# EAGLE design MCB-iMX7-WARP-v1.0.0 (EAGLE 7.7.0)

## Sheet 1 of 2
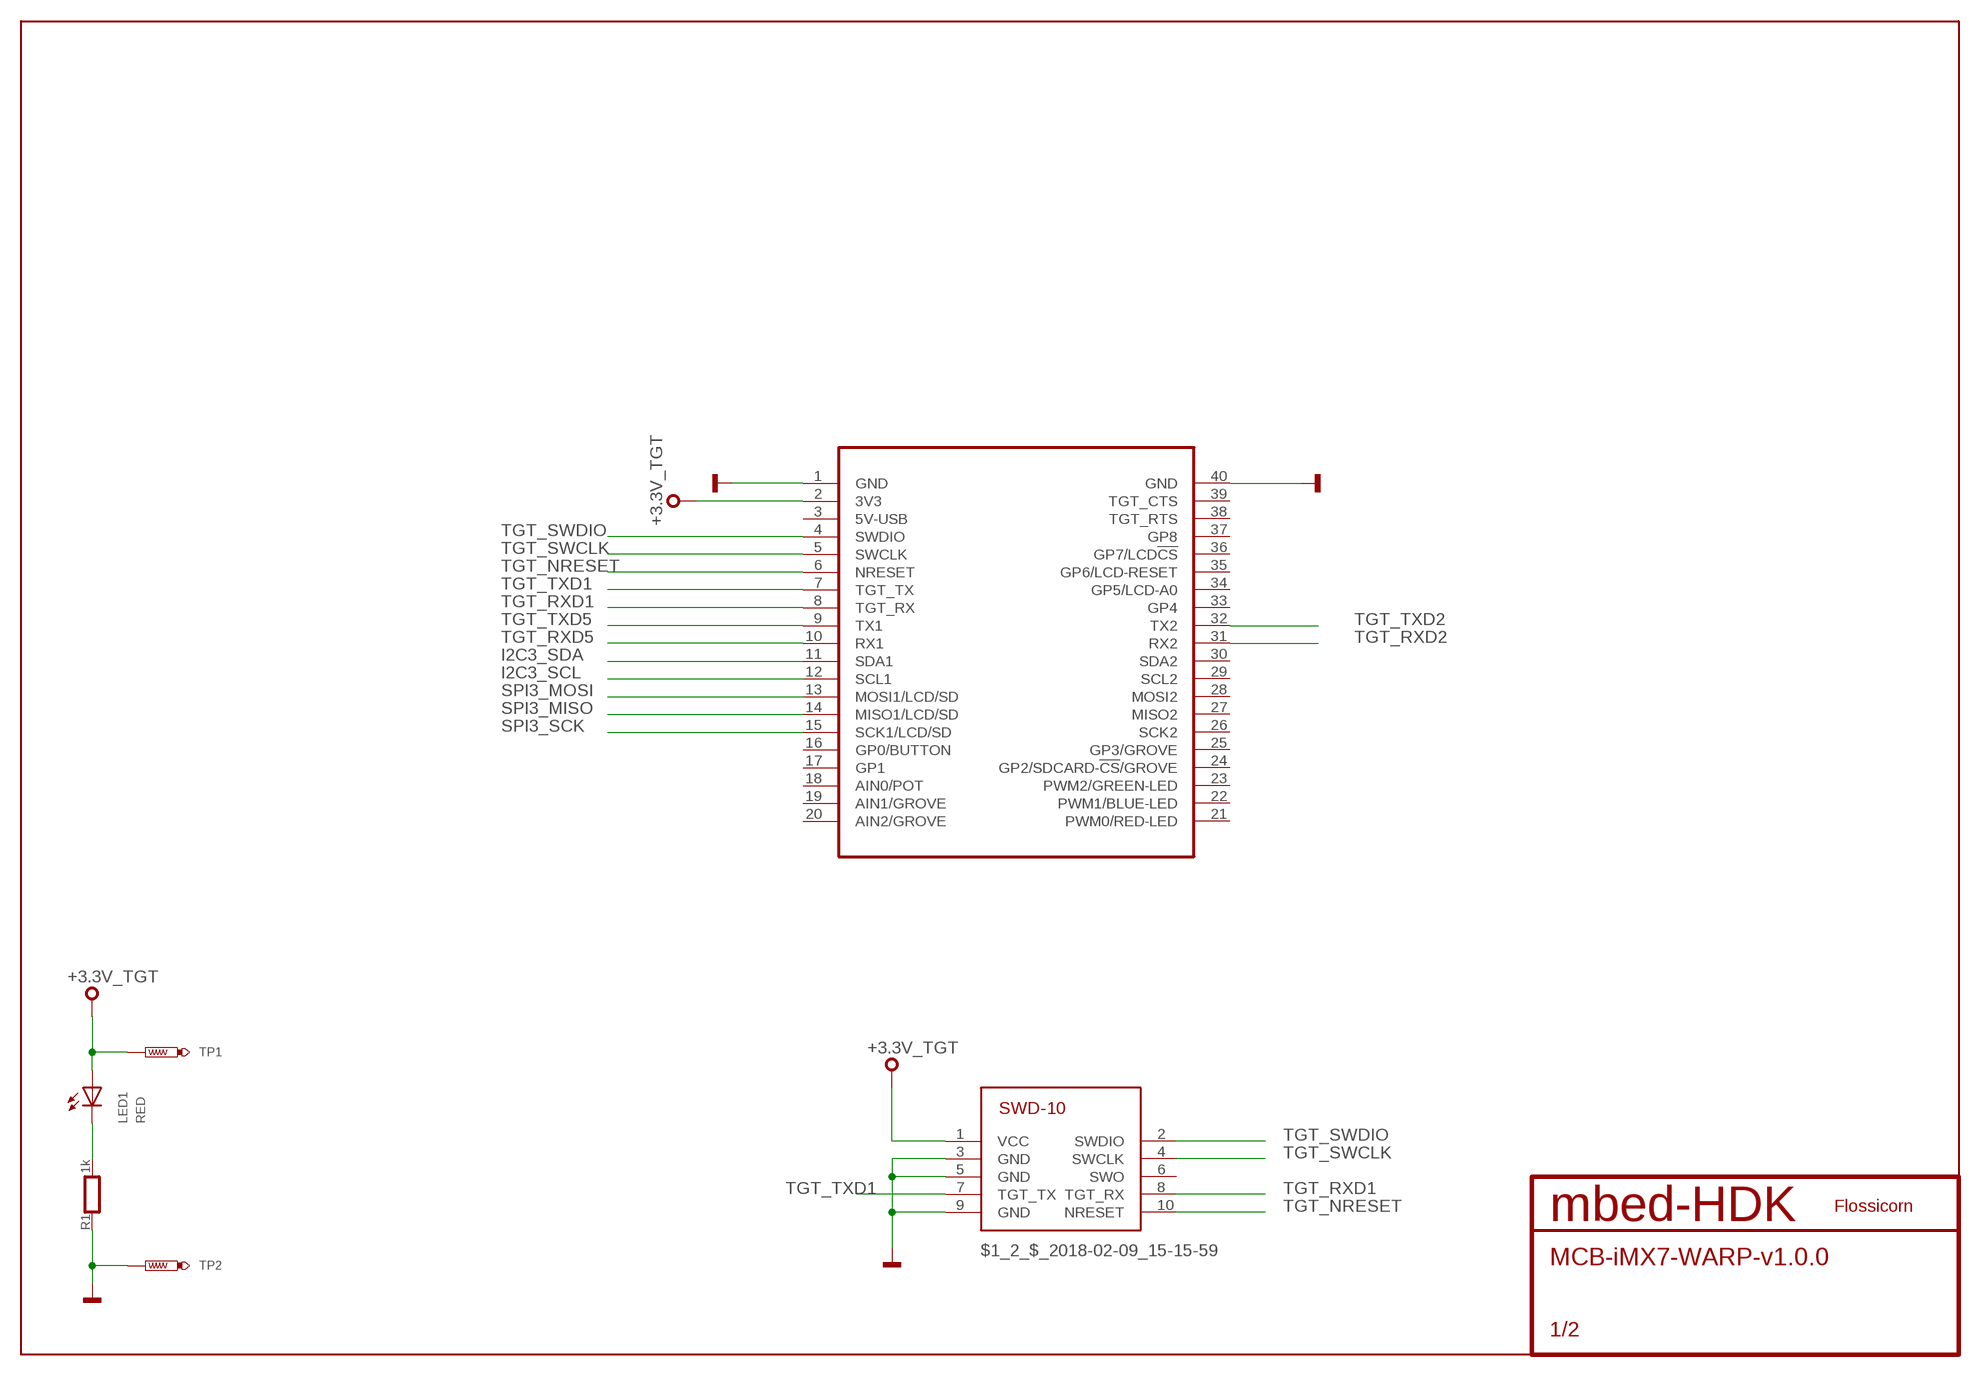
[diagram p0: schematic, sheet 1]

### Parts
$1_2_$_2018-02-09_15-15-59  SWD-10/TC2050_SMD  [FTSH-105-02]
LED1  RED  SMD_LED0603  [CHIPLED_0603]
MOD1  MODULE_DAUGHTER  [MODULE_DAUGHTER]
R1  1k  RESISTOR0603  [0603]
SS1  FLOSSICORN0.5  [FLOSSICORN-0.5]
TP1  TEST-POINT-50R-PTH  [TP50-PTH]
TP2  TEST-POINT-50R-PTH  [TP50-PTH]

### Nets
+3.3V_TGT: $1_2_$_2018-02-09_15-15-59.1(VCC) LED1.A MOD1.2(3V3) TP1.TP ; also sheet 2
GND: $1_2_$_2018-02-09_15-15-59.3(GND) $1_2_$_2018-02-09_15-15-59.5(GND) $1_2_$_2018-02-09_15-15-59.9(GND) MOD1.1(GND) MOD1.40(GND) R1.1 TP2.TP ; also sheet 2
I2C3_SCL: MOD1.12(SCL1) ; also sheet 2
I2C3_SDA: MOD1.11(SDA1) ; also sheet 2
PA_1: LED1.C R1.2
SPI3_MISO: MOD1.14(MISO1/LCD/SD) ; also sheet 2
SPI3_MOSI: MOD1.13(MOSI1/LCD/SD) ; also sheet 2
SPI3_SCK: MOD1.15(SCK1/LCD/SD) ; also sheet 2
TGT_NRESET: $1_2_$_2018-02-09_15-15-59.10(NRESET) MOD1.6(NRESET)
TGT_RXD1: $1_2_$_2018-02-09_15-15-59.8(TGT_RX) MOD1.8(TGT_RX) ; also sheet 2
TGT_RXD2: MOD1.31(RX2) ; also sheet 2
TGT_RXD5: MOD1.10(RX1) ; also sheet 2
TGT_SWCLK: $1_2_$_2018-02-09_15-15-59.4(SWCLK) MOD1.5(SWCLK) ; also sheet 2
TGT_SWDIO: $1_2_$_2018-02-09_15-15-59.2(SWDIO) MOD1.4(SWDIO) ; also sheet 2
TGT_TXD1: $1_2_$_2018-02-09_15-15-59.7(TGT_TX) MOD1.7(TGT_TX) ; also sheet 2
TGT_TXD2: MOD1.32(TX2) ; also sheet 2
TGT_TXD5: MOD1.9(TX1) ; also sheet 2
Unconnected: $1_2_$_2018-02-09_15-15-59.6(SWO) MOD1.3(5V-USB) MOD1.16(GP0/BUTTON) MOD1.17(GP1) MOD1.18(AIN0/POT) MOD1.19(AIN1/GROVE) MOD1.20(AIN2/GROVE) MOD1.21(PWM0/RED-LED) MOD1.22(PWM1/BLUE-LED) MOD1.23(PWM2/GREEN-LED) MOD1.24(GP2/SDCARD-!CS!/GROVE) MOD1.25(GP3/GROVE) MOD1.26(SCK2) MOD1.27(MISO2) MOD1.28(MOSI2) MOD1.29(SCL2) MOD1.30(SDA2) MOD1.33(GP4) MOD1.34(GP5/LCD-A0) MOD1.35(GP6/LCD-RESET) MOD1.36(GP7/LCD!CS) MOD1.37(GP8) MOD1.38(TGT_RTS) MOD1.39(TGT_CTS)

## Sheet 2 of 2
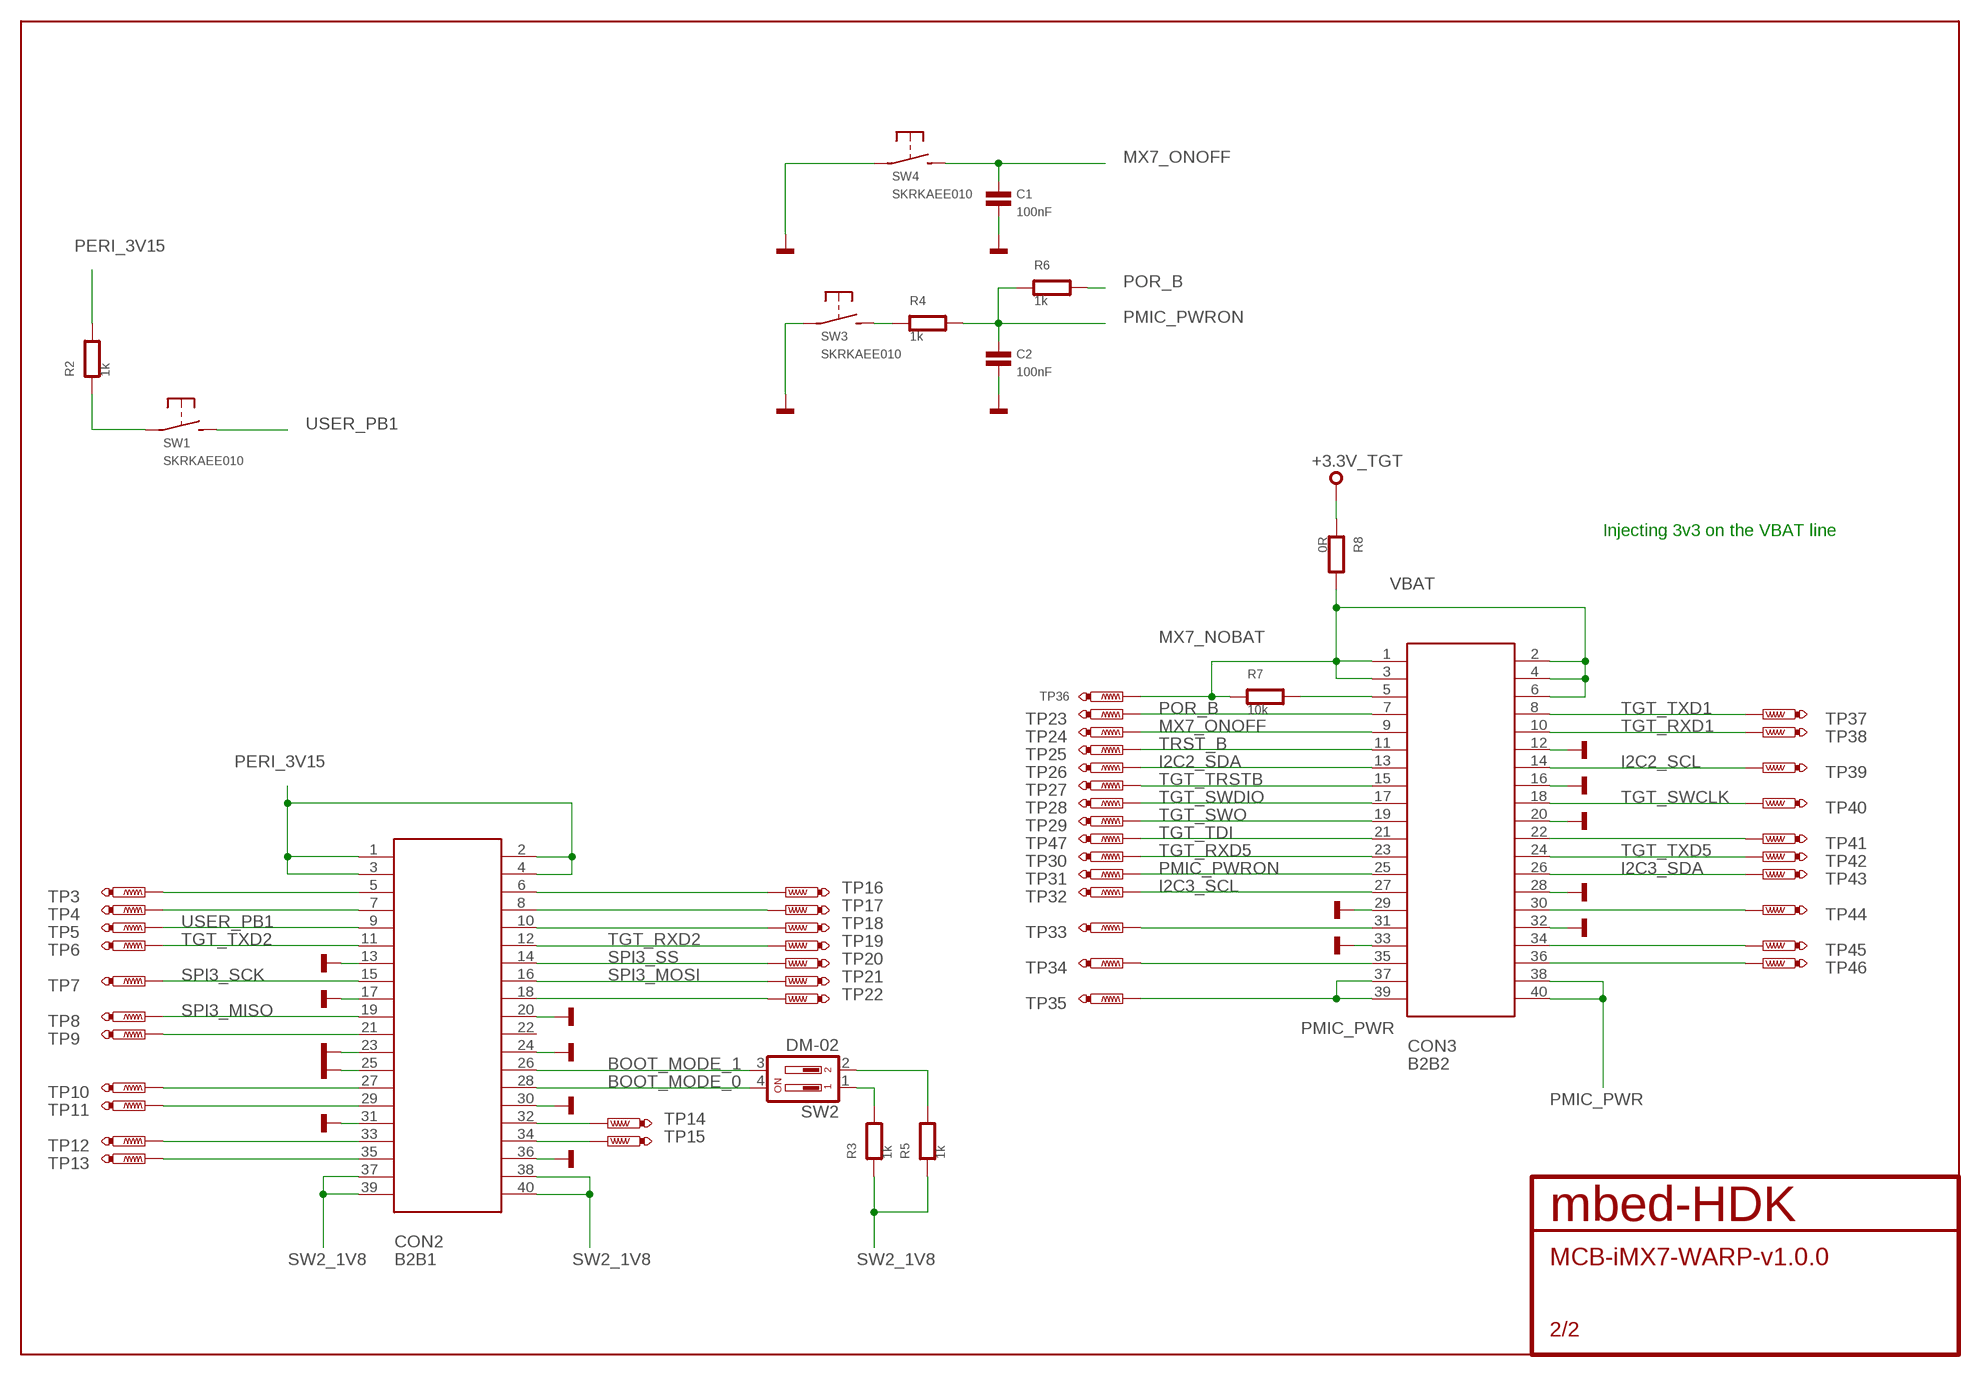
[diagram p1: schematic, sheet 2]

### Parts
C1  100nF  CAPACITOR0603  [0603]
C2  100nF  CAPACITOR0603  [0603]
CON2  B2B1  DF40HC-XX-40DS-XX-V  [DF40HC-XX-40DS-XX-V]
CON3  B2B2  DF40HC-XX-40DS-XX-V  [DF40HC-XX-40DS-XX-V]
R2  1k  RESISTOR0603  [0603]
R3  1k  RESISTOR0603  [0603]
R4  1k  RESISTOR0603  [0603]
R5  1k  RESISTOR0603  [0603]
R6  1k  RESISTOR0603  [0603]
R7  10k  RESISTOR0603  [0603]
R8  0R  RESISTOR0603  [0603]
SW1  SKRKAEE010  [SKRKAEE010]
SW2  DM-02  [DM-02]
SW3  SKRKAEE010  [SKRKAEE010]
SW4  SKRKAEE010  [SKRKAEE010]
TP3  PTR1TP06R  [TP06R]
TP4  PTR1TP06R  [TP06R]
TP5  PTR1TP06R  [TP06R]
TP6  PTR1TP06R  [TP06R]
TP7  PTR1TP06R  [TP06R]
TP8  PTR1TP06R  [TP06R]
TP9  PTR1TP06R  [TP06R]
TP10  PTR1TP06R  [TP06R]
TP11  PTR1TP06R  [TP06R]
TP12  PTR1TP06R  [TP06R]
TP13  PTR1TP06R  [TP06R]
TP14  PTR1TP06R  [TP06R]
TP15  PTR1TP06R  [TP06R]
TP16  PTR1TP06R  [TP06R]
TP17  PTR1TP06R  [TP06R]
TP18  PTR1TP06R  [TP06R]
TP19  PTR1TP06R  [TP06R]
TP20  PTR1TP06R  [TP06R]
TP21  PTR1TP06R  [TP06R]
TP22  PTR1TP06R  [TP06R]
TP23  PTR1TP06R  [TP06R]
TP24  PTR1TP06R  [TP06R]
TP25  PTR1TP06R  [TP06R]
TP26  PTR1TP06R  [TP06R]
TP27  PTR1TP06R  [TP06R]
TP28  PTR1TP06R  [TP06R]
TP29  PTR1TP06R  [TP06R]
TP30  PTR1TP06R  [TP06R]
TP31  PTR1TP06R  [TP06R]
TP32  PTR1TP06R  [TP06R]
TP33  PTR1TP06R  [TP06R]
TP34  PTR1TP06R  [TP06R]
TP35  PTR1TP10R  [TP10R]
TP36  TEST-POINT-50R-SMD  [TP50-SMD]
TP37  PTR1TP06R  [TP06R]
TP38  PTR1TP06R  [TP06R]
TP39  PTR1TP06R  [TP06R]
TP40  PTR1TP06R  [TP06R]
TP41  PTR1TP06R  [TP06R]
TP42  PTR1TP06R  [TP06R]
TP43  PTR1TP06R  [TP06R]
TP44  PTR1TP06R  [TP06R]
TP45  PTR1TP06R  [TP06R]
TP46  PTR1TP06R  [TP06R]
TP47  PTR1TP06R  [TP06R]

### Nets
+3.3V_TGT: R8.1 ; also sheet 1
BOOT_MODE_0: CON2.28 SW2.4
BOOT_MODE_1: CON2.26 SW2.3
GND: C1.2 C2.2 CON2.13 CON2.17 CON2.20 CON2.23 CON2.24 CON2.25 CON2.30 CON2.31 CON2.36 CON3.12 CON3.16 CON3.20 CON3.28 CON3.29 CON3.32 CON3.33 SW3.P$1(P) SW4.P$1(P) ; also sheet 1
I2C2_SCL: CON3.14 TP39.TP
I2C2_SDA: CON3.13 TP26.TP
I2C3_SCL: CON3.27 TP32.TP ; also sheet 1
I2C3_SDA: CON3.26 TP43.TP ; also sheet 1
MX7_NOBAT: CON3.5 R7.2
MX7_ONOFF: C1.1 CON3.9 SW4.P$2(S) TP24.TP
N$1: R4.1 SW3.P$2(S)
N$10: R2.1 SW1.P$1(P)
N$15: CON3.36 TP46.TP
N$16: CON3.22 TP41.TP
N$17: CON3.30 TP44.TP
N$18: CON3.34 TP45.TP
N$20: R3.2 SW2.1
N$21: R5.2 SW2.2
N$23: CON3.31 TP33.TP
N$24: CON3.35 TP34.TP
N$25: CON2.5 TP3.TP
N$26: CON2.7 TP4.TP
N$27: CON2.21 TP9.TP
N$28: CON2.27 TP10.TP
N$29: CON2.29 TP11.TP
N$30: CON2.33 TP12.TP
N$31: CON2.35 TP13.TP
N$32: CON2.34 TP15.TP
N$33: CON2.32 TP14.TP
N$35: CON2.18 TP22.TP
N$36: CON2.10 TP18.TP
N$37: CON2.8 TP17.TP
N$38: CON2.6 TP16.TP
PERI_3V15: CON2.1 CON2.2 CON2.3 CON2.4 R2.2
PMIC_PWR: CON3.37 CON3.38 CON3.39 CON3.40 TP35.TP
PMIC_PWRON: C2.1 CON3.25 R4.2 R6.1 TP31.TP
POR_B: CON3.7 R6.2 TP23.TP
SPI3_MISO: CON2.19 TP8.TP ; also sheet 1
SPI3_MOSI: CON2.16 TP21.TP ; also sheet 1
SPI3_SCK: CON2.15 TP7.TP ; also sheet 1
SPI3_SS: CON2.14 TP20.TP
SW2_1V8: CON2.37 CON2.38 CON2.39 CON2.40 R3.1 R5.1
TGT_RXD1: CON3.10 TP38.TP ; also sheet 1
TGT_RXD2: CON2.12 TP19.TP ; also sheet 1
TGT_RXD5: CON3.23 TP30.TP ; also sheet 1
TGT_SWCLK: CON3.18 TP40.TP ; also sheet 1
TGT_SWDIO: CON3.17 TP28.TP ; also sheet 1
TGT_SWO: CON3.19 TP29.TP
TGT_TDI: CON3.21 TP47.TP
TGT_TRSTB: CON3.15 TP27.TP
TGT_TXD1: CON3.8 TP37.TP ; also sheet 1
TGT_TXD2: CON2.11 TP6.TP ; also sheet 1
TGT_TXD5: CON3.24 TP42.TP ; also sheet 1
TRST_B: CON3.11 TP25.TP
USER_PB1: CON2.9 SW1.P$2(S) TP5.TP
VBAT: CON3.1 CON3.2 CON3.3 CON3.4 CON3.6 R7.1 R8.2 TP36.TP
Unconnected: CON2.22

### Notes on the sheet
- Injecting 3v3 on the VBAT line

## Library data of the parts
$1_2_$_2018-02-09_15-15-59 = mbed-HDK-Connector:SWD-10/TC2050: 1mm pitch 10-Pin Cortex Programming Header with optional TC2050 footprint solderless interchangeable
C1 C2 = mbed-HDK-RLC:CAPACITOR: Capacitor
CON2 CON3 = Treadstone:DF40HC-XX-40DS-XX-V
LED1 = mbed-HDK-Optical:SMD_LED: LED SMD, Colour Red; MF: Wurth Electronics Inc; MFN: 150060RS75000; OC-DIGIKEY: 732-4978-1-ND; OC-MOUSER: 710-150060RS75000; OC-NEWARK: 2322071
MOD1 = blackbriar:MODULE_DAUGHTER
R1-R8 = mbed-HDK-RLC:RESISTOR: Resistor
SS1 = blackbriar:FLOSSICORN
SW1 SW3 SW4 = mbed-HDK-Switch:SKRKAEE010: MOMENTARY SWITCH PUSH VERTICAL (SPST); MF: ALPS; MFN: SKRKAEE010; OC-MOUSER: 688-SKRKAE
SW2 = LabBoard:DM-02
TP1 TP2 TP36 = mbed-HDK:TEST-POINT
TP3-TP35 TP37-TP47 = testpad:PTR1: TEST PIN

## Board
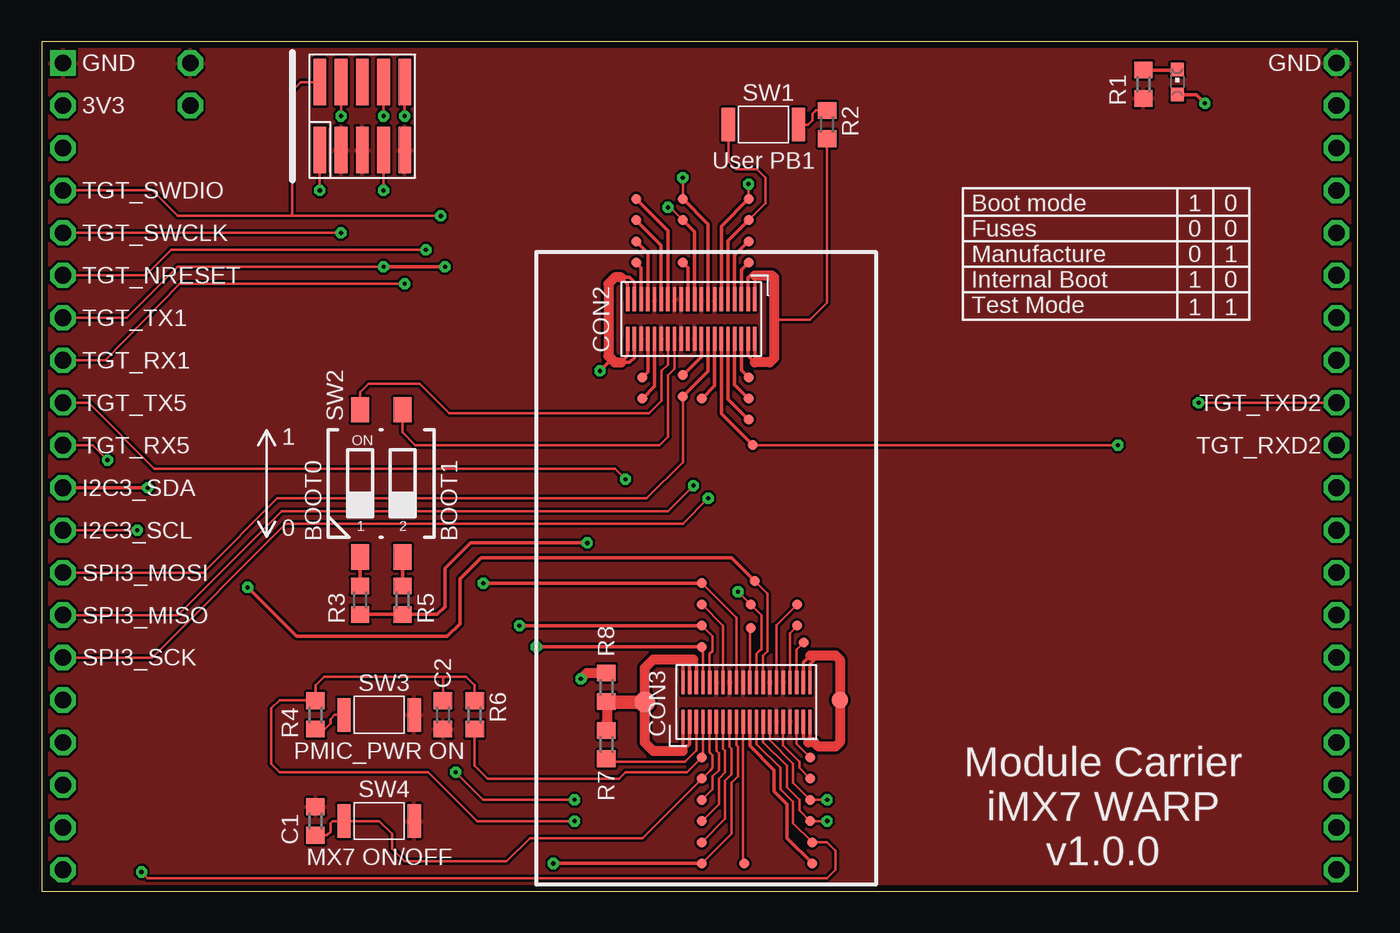
[diagram p2: board, top side]
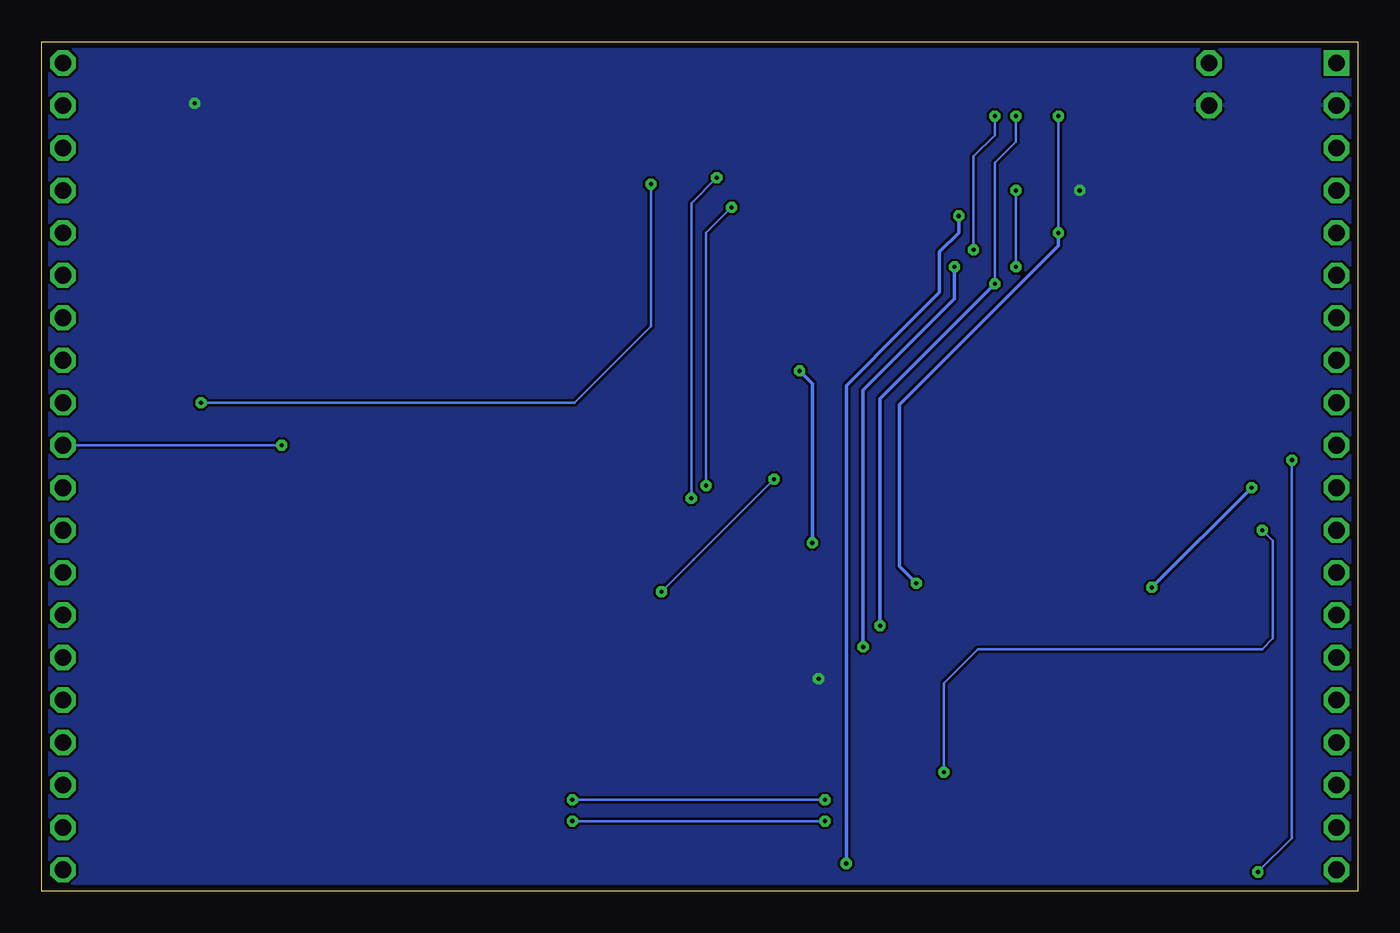
[diagram p3: board, bottom side, seen from below]

Size 78.74 x 50.8 mm. Coordinates in mm from the lower left corner, seen from the top.
Copper layers ((1*16)): Top 0.035mm / dielectric 0.8mm / Bottom 0.035mm
Design rules "mbed-HDK-6-6-2-layer": minimum track width 6mil, minimum drill 9mil, track to track 6mil, track to pad 6mil, pad to pad 6mil, via to via 6mil, smd to smd 6mil, copper to edge 15mil, drill to drill 8mil, minimum pad ring 10mil, minimum via ring 8mil, stop-mask expansion 4mil, vias tented up to drill 0mil, thermal gap 6mil

### Footprints (pad centres in the part's own frame; a part is rotated, then mirrored left to right if it is on the bottom)
FTSH-105-02 = smd 0.762 x 2.794: 1 0.381,-2.032; 2 0.381,2.032; 3 1.651,-2.032; 4 1.651,2.032; 5 2.921,-2.032; 6 2.921,2.032; 7 4.191,-2.032; 8 4.191,2.032; 9 5.461,-2.032; 10 5.461,2.032
0603 = smd 1 x 1.1: 1 -0.85,0; 2 0.85,0
DF40HC-XX-40DS-XX-V = smd 0.2 x 1.43: 1 -3.8,-1.175; 2 -3.8,1.175; 3 -3.4,-1.175; 4 -3.4,1.175; 5 -3,-1.175; 6 -3,1.175; 7 -2.6,-1.175; 8 -2.6,1.175; 9 -2.2,-1.175; 10 -2.2,1.175; 11 -1.8,-1.175; 12 -1.8,1.175; 13 -1.4,-1.175; 14 -1.4,1.175; 15 -1,-1.175; 16 -1,1.175; 17 -0.6,-1.175; 18 -0.6,1.175; 19 -0.2,-1.175; 20 -0.2,1.175; 21 0.2,-1.175; 22 0.2,1.175; 23 0.6,-1.175; 24 0.6,1.175; 25 1,-1.175; 26 1,1.175; 27 1.4,-1.175; 28 1.4,1.175; 29 1.8,-1.175; 30 1.8,1.175; 31 2.2,-1.175; 32 2.2,1.175; 33 2.6,-1.175; 34 2.6,1.175; 35 3,-1.175; 36 3,1.175; 37 3.4,-1.175; 38 3.4,1.175; 39 3.8,-1.175; 40 3.8,1.175
CHIPLED_0603 = smd 0.8 x 0.8: A 0,-0.75; C 0,0.75
MODULE_DAUGHTER = drill 1 square: 1 0,0 | drill 1 octagon: 2 0,-2.54; 3 0,-5.08; 4 0,-7.62; 5 0,-10.16; 6 0,-12.7; 7 0,-15.24; 8 0,-17.78; 9 0,-20.32; 10 0,-22.86; 11 0,-25.4; 12 0,-27.94; 13 0,-30.48; 14 0,-33.02; 15 0,-35.56; 16 0,-38.1; 17 0,-40.64; 18 0,-43.18; 19 0,-45.72; 20 0,-48.26; 21 76.2,-48.26; 22 76.2,-45.72; 23 76.2,-43.18; 24 76.2,-40.64; 25 76.2,-38.1; 26 76.2,-35.56; 27 76.2,-33.02; 28 76.2,-30.48; 29 76.2,-27.94; 30 76.2,-25.4; 31 76.2,-22.86; 32 76.2,-20.32; 33 76.2,-17.78; 34 76.2,-15.24; 35 76.2,-12.7; 36 76.2,-10.16; 37 76.2,-7.62; 38 76.2,-5.08; 39 76.2,-2.54; 40 76.2,0
SKRKAEE010 = smd 0.8 x 2: P$1 -2.1,0; P$2 2.1,0
DM-02 = smd 1.1 x 1.5: 1 -1.27,-4.4; 2 1.27,-4.4; 3 1.27,4.4; 4 -1.27,4.4
TP50-PTH = drill 1 octagon: TP 0,0
TP06R = smd 0.6 x 0.6: TP 0,0
TP10R = smd 1 x 1: TP 0,0
TP50-SMD = smd 1.27 x 1.27: TP 0,0

### Placement (x,y rotation side)
$1_2_$_2018-02-09_15-15-59  16.26,46.36 0 top
C1  16.38,4.19 90 top
C2  24,10.54 270 top
CON2  38.86,34.21 180 top
CON3  42.16,11.3 0 top
LED1  67.94,48.39 0 top
MOD1  1.27,49.53 0 top
R1  65.91,48.26 90 top
R2  46.99,45.85 270 top
R3  19.05,17.4 90 top
R4  16.38,10.54 90 top
R5  21.59,17.4 90 top
R6  25.91,10.54 270 top
R7  33.78,8.76 270 top
R8  33.78,12.19 270 top
SS1  25.65,41.27 0 top
SW1  43.18,45.85 180 top
SW2  20.32,24.38 0 top
SW3  20.19,10.54 180 top
SW4  20.19,4.19 180 top
TP1  8.89,46.99 0 top
TP2  8.89,49.53 0 top
TP3  42.29,37.59 0 top
TP4  42.29,38.86 0 top
TP5  42.29,40.13 270 top
TP6  42.29,41.4 270 top
TP7  38.35,41.4 270 top
TP8  38.35,40.13 270 top
TP9  38.35,37.59 0 top
TP10  35.56,41.4 0 top
TP11  35.56,40.13 0 top
TP12  35.56,38.86 0 top
TP13  35.56,37.59 0 top
TP14  35.94,29.46 0 top
TP15  35.94,30.73 0 top
TP16  42.29,30.73 0 top
TP17  42.29,29.46 0 top
TP18  42.29,28.19 0 top
TP19  42.55,26.67 270 top
TP20  39.5,29.46 270 top
TP21  38.35,29.59 270 top
TP22  38.35,30.86 0 top
TP23  39.5,8 90 top
TP24  39.5,6.73 90 top
TP25  39.5,5.46 90 top
TP26  39.5,4.19 90 top
TP27  39.5,2.92 90 top
TP28  39.5,1.65 90 top
TP29  42.04,1.65 90 top
TP30  46.1,2.92 90 top
TP31  45.97,4.19 90 top
TP32  45.97,5.46 90 top
TP33  45.97,6.73 90 top
TP34  45.97,8 90 top
TP35  47.75,11.43 90 top
TP36  36.07,11.3 270 top
TP37  39.5,14.61 270 top
TP38  39.5,15.88 270 top
TP39  39.5,17.15 270 top
TP40  39.5,18.42 270 top
TP41  42.42,15.75 270 top
TP42  42.42,17.15 270 top
TP43  42.67,18.54 270 top
TP44  45.21,17.15 270 top
TP45  45.21,15.88 270 top
TP46  45.59,14.86 270 top
TP47  46.1,1.65 0 top

### Tracks (layer width: path | path; a pad name or v marks a point on that pad's centre or on a via)
+3.3V_TGT  (via drill 0.25)
  Top 0.152: $1_2_$_2018-02-09_15-15-59.1 v16.64,41.91
  Top 0.203: LED1.A 69.09,47.62 v69.6,47.12
  Top 0.61: R8.1 32.6,13.04 v32.26,12.7
  pour Bottom: 0,0 0,50.8 78.74,50.8 78.74,0
BOOT_MODE_0
  Top 0.152: CON2.28 37.46,31.49 37.08,31.12 37.08,29.34 36.32,28.58 24.38,28.58 22.61,30.35 19.56,30.35 19.05,29.85 SW2.4
BOOT_MODE_1
  Top 0.152: SW2.3 21.59,27.43 22.35,26.67 36.96,26.67 37.47,27.18 37.47,30.86 37.85,31.24 37.85,33.02 CON2.26
GND
  pour Top: 0,0 0,50.8 78.74,50.8 78.74,0
I2C2_SCL
  Top 0.152: CON3.14 40.76,15.88 TP39.TP
I2C2_SDA
  Top 0.152: CON3.13 40.77,8.51 40.89,8.38 40.89,8.26 40.89,7.11 40.51,6.73 40.51,5.21 TP26.TP
I2C3_SCL  (via drill 0.25)
  Top 0.152: CON3.27 43.56,9.01 44.96,7.62 44.96,6.48 TP32.TP v46.99,5.46 | v31.88,5.46 26.42,5.46 v24.77,7.11 | v5.71,21.59 MOD1.12
  Bottom 0.152: v46.99,5.46 v31.88,5.46 | v24.77,7.11 24.77,12.45 22.73,14.48 5.71,14.48 5.08,15.11 5.08,20.96 v5.71,21.59
I2C3_SDA  (via drill 0.25)
  Top 0.152: CON3.26 43.16,14.08 43.43,14.35 43.43,17.78 TP43.TP
  Top 0.203: TP43.TP 41.28,19.94 38.48,19.94 26.29,19.94 25.02,18.67 25.02,16 24.26,15.24 15.24,15.24 v12.32,18.16 | v6.35,24.13 MOD1.11
  Bottom 0.203: v12.32,18.16 v6.35,24.13
MX7_NOBAT
  Top 0.152: CON3.5 39.16,8.43 38.48,7.75 33.95,7.75 R7.2
MX7_ONOFF
  Top 0.152: CON3.9 39.96,8.3 40.01,8.26 40.13,8.13 40.13,7.37 40.01,7.24 TP24.TP 35.94,3.18 29.21,3.18 27.81,1.78 21.72,1.78 20.95,2.54 20.95,3.43 20.19,4.19 SW4.P$2 17.4,4.19 17.27,4.06 17.27,3.56 17.06,3.34 C1.1
N$1
  Top 0.152: R4.1 16.93,9.69 17.27,10.03 17.27,10.29 17.53,10.54 SW3.P$2
N$10
  Top 0.152: SW1.P$1 45.85,45.85 46.1,46.1 46.1,46.48 46.23,46.61 46.32,46.7 R2.1
N$15
  Top 0.152: CON3.36 45.16,14.43 TP46.TP
N$16
  Top 0.152: CON3.22 42.36,15.69 TP41.TP
N$17
  Top 0.152: CON3.30 43.96,15.9 TP44.TP
N$18
  Top 0.152: CON3.34 44.76,15.43 TP45.TP
N$20
  Top 0.203: SW2.1 R3.2
N$21
  Top 0.203: SW2.2 R5.2
N$23
  Top 0.152: CON3.31 44.36,8.72 45.34,7.75 45.34,7.37 TP33.TP
N$24
  Top 0.152: CON3.35 45.16,8.81 TP34.TP
N$25
  Top 0.203: CON2.5 41.86,37.16 TP3.TP
N$26
  Top 0.203: CON2.7 41.46,38.03 TP4.TP
N$27
  Top 0.203: CON2.21 38.66,37.28 TP9.TP
N$28
  Top 0.203: CON2.27 37.46,39.5 TP10.TP
N$29
  Top 0.203: CON2.29 37.06,38.63 TP11.TP
N$30
  Top 0.203: CON2.33 36.26,38.16 TP12.TP
N$31
  Top 0.203: CON2.35 35.86,37.29 TP13.TP
N$32
  Top 0.203: CON2.34 36.26,31.05 TP15.TP
N$33
  Top 0.203: CON2.32 36.66,30.19 TP14.TP
N$35
  Top 0.203: CON2.18 39.46,31.97 TP22.TP
N$36
  Top 0.203: CON2.10 41.06,29.42 TP18.TP
N$37
  Top 0.203: CON2.8 41.46,30.29 TP17.TP
N$38
  Top 0.203: CON2.6 41.86,31.16 TP16.TP
PA_1
  Top 0.203: R1.2 67.92,49.11 LED1.C
PERI_3V15
  Top 0.152: R2.2 46.99,35.18 45.97,34.16 43.82,34.16
  Top 0.203: CON2.3 42.26,36.67 42.42,36.83 42.67,36.83 | CON2.2 42.67,33.03 42.67,31.62 42.26,32.03 CON2.4 | CON2.1 42.66,36.69 42.8,36.83
  Top 0.61: 42.67,36.83 42.8,36.83 43.69,36.83 43.82,36.7 43.82,34.16 43.82,31.88 43.56,31.62 42.67,31.62
PMIC_PWR
  Top 0.203: CON3.38 45.56,13.69 45.97,14.1 | CON3.40 45.96,13.58 46.48,14.1 | 45.85,8.89 45.59,9.14 45.56,9.17 CON3.37 | CON3.39 45.96,9.15 46.29,8.83
  Top 0.61: 45.97,14.1 46.48,14.1 47.5,14.1 47.75,13.84 TP35.TP 47.75,8.89 47.5,8.64 46.48,8.64 46.29,8.83 46.23,8.89 45.85,8.89
PMIC_PWRON  (via drill 0.25)
  Top 0.152: CON3.25 43.16,8.91 44.58,7.49 44.58,6.22 45.34,5.46 45.34,4.83 TP31.TP v46.99,4.19 | 24.13,12.83 16.89,12.83 16.38,12.32 R4.2 16.34,11.43 14.22,11.43 13.72,10.92 13.72,7.62 14.22,7.11 23.11,7.11 26.04,4.19 v31.88,4.19 | 24.13,12.83 25.4,12.83 25.91,12.32 R6.1 | C2.1 24,12.7 24.13,12.83
  Bottom 0.152: v46.99,4.19 v31.88,4.19
POR_B
  Top 0.152: CON3.7 39.56,8.07 TP23.TP 38.61,7.11 34.93,7.11 34.54,6.73 26.67,6.73 25.91,7.49 R6.2
SPI3_MISO  (via drill 0.25)
  Top 0.152: MOD1.14 8.13,16.51 14.35,22.73 35.43,22.73 37.47,22.73 v38.99,24.26 | v37.47,40.89 37.59,40.89 TP8.TP
  Top 0.203: CON2.19 39.06,39.42 TP8.TP
  Bottom 0.152: v38.99,24.26 38.99,39.37 v37.47,40.89
SPI3_MOSI
  Top 0.152: MOD1.13 9.65,19.05 14.1,23.5 35.43,23.5 36.2,23.5 38.35,25.65 TP21.TP
  Top 0.203: CON2.16 39.86,31.1 TP21.TP
SPI3_SCK  (via drill 0.25)
  Top 0.152: MOD1.15 6.6,13.97 14.61,21.97 35.43,21.97 38.35,21.97 v39.88,23.5 | v38.35,42.67 TP7.TP
  Top 0.203: CON2.15 39.86,39.89 TP7.TP
  Bottom 0.152: v39.88,23.5 39.88,41.15 v38.35,42.67
SPI3_SS
  Top 0.203: CON2.14 40.26,30.23 TP20.TP
SW2_1V8  (via drill 0.25)
  Top 0.203: CON2.37 35.46,36.42 35.18,36.7 34.67,36.7 35.06,36.31 CON2.39 | CON2.38 35.46,31.91 35.18,31.62 34.67,31.62 35.06,32.01 CON2.40 | R3.1 R5.1 23.66,16.55 24.13,17.02 24.13,19.3 25.65,20.83 v32.64,20.83 | v33.4,31.12 34.1,31.81
  Top 0.61: 34.67,36.7 34.29,36.7 33.91,36.32 33.91,32 34.1,31.81 34.29,31.62 34.67,31.62
  Bottom 0.203: v32.64,20.83 32.64,30.35 v33.4,31.12
TGT_NRESET  (via drill 0.25)
  Top 0.152: MOD1.6 6.22,36.83 7.75,38.35 v22.99,38.35 | $1_2_$_2018-02-09_15-15-59.10 v21.72,46.36
  Bottom 0.152: v21.72,46.36 21.72,45.21 22.99,43.94 22.99,43.56 v22.99,38.35
TGT_RXD1  (via drill 0.25)
  Top 0.152: CON3.10 39.96,14.18 40.13,14.35 40.13,15.24 TP38.TP | MOD1.8 3.81,31.75 8.26,36.32 v21.72,36.32 | $1_2_$_2018-02-09_15-15-59.8 v20.45,46.36
  Top 0.203: v28.57,15.88 TP38.TP
  Bottom 0.152: v20.45,46.36 20.45,44.83 21.72,43.56 v21.72,36.32
  Bottom 0.203: v21.72,36.32 28.57,29.46 v28.57,15.88
TGT_RXD2  (via drill 0.25)
  Top 0.152: TP19.TP 63.75,26.67 v64.39,26.67
  Top 0.203: CON2.12 40.66,28.55 TP19.TP
  Bottom 0.152: v64.39,26.67 MOD1.31
TGT_RXD5  (via drill 0.25)
  Top 0.152: CON3.23 42.76,8.8 44.2,7.37 44.2,6.1 44.96,5.33 44.96,4.06 TP30.TP 46.99,2.92 47.5,2.41 47.5,1.27 46.99,0.76 6.35,0.76 v5.97,1.14 | MOD1.10 3.05,26.67 v3.94,25.78
  Bottom 0.152: v3.94,25.78 3.94,3.18 v5.97,1.14
TGT_SWCLK  (via drill 0.25)
  Top 0.152: CON3.18 41.56,16.35 TP40.TP | MOD1.5 v17.91,39.37 | $1_2_$_2018-02-09_15-15-59.4 v17.91,46.36
  Top 0.203: v26.42,18.42 TP40.TP
  Bottom 0.152: v17.91,46.36 v17.91,39.37
  Bottom 0.203: v17.91,39.37 17.91,38.61 22.99,33.53 27.43,29.08 27.43,19.43 v26.42,18.42
TGT_SWDIO  (via drill 0.25)
  Top 0.152: CON3.17 41.56,8.73 41.66,8.64 41.66,6.86 41.28,6.48 41.28,3.43 TP28.TP | MOD1.4 6.6,41.91 8.13,40.39 14.99,40.39 | 14.99,40.39 v23.88,40.39 | $1_2_$_2018-02-09_15-15-59.2 15.49,48.39 14.99,47.88 14.99,40.39
  Top 0.203: v30.61,1.65 TP28.TP
  Bottom 0.203: v23.88,40.39 23.88,39.37 25.02,38.23 25.02,35.81 27.18,33.66 30.61,30.23 v30.61,1.65
TGT_SWO
  Top 0.152: CON3.19 41.96,1.72 TP29.TP
TGT_TDI
  Top 0.203: CON3.21 42.36,8.69 43.82,7.24 43.82,5.97 44.58,5.21 44.58,3.18 TP47.TP
TGT_TRSTB
  Top 0.152: CON3.15 41.16,8.62 41.28,8.51 41.28,6.98 40.89,6.6 40.89,4.32 TP27.TP
TGT_TXD1  (via drill 0.25)
  Top 0.152: CON3.8 39.56,14.54 TP37.TP | MOD1.7 5.08,34.29 8.13,37.34 v20.45,37.34 | $1_2_$_2018-02-09_15-15-59.7 v20.45,41.91
  Top 0.203: v20.45,37.34 v24.13,37.34 | v29.59,14.61 TP37.TP
  Bottom 0.152: v20.45,41.91 v20.45,37.34
  Bottom 0.203: v24.13,37.34 24.13,35.43 29.08,30.48 29.34,30.23 29.59,29.97 v29.59,14.61
TGT_TXD2  (via drill 0.25)
  Top 0.152: TP6.TP v42.29,42.29 | v69.21,29.21 MOD1.32
  Top 0.203: CON2.11 40.66,39.77 TP6.TP
  Bottom 0.152: v42.29,42.29 42.29,33.78 46.86,29.21 v69.21,29.21
TGT_TXD5  (via drill 0.25)
  Top 0.152: CON3.24 42.76,14.19 42.93,14.35 43.05,14.48 43.05,16.51 TP42.TP v41.66,17.91 | MOD1.9 2.79,29.21 6.73,25.27 34.29,25.27 v34.93,24.64
  Bottom 0.152: v34.93,24.64 39.75,19.81 v41.66,17.91
TRST_B
  Top 0.152: CON3.11 40.36,8.4 40.39,8.38 40.51,8.26 40.51,7.24 40.13,6.86 40.13,6.48 40.13,6.1 TP25.TP
USER_PB1
  Top 0.152: SW1.P$2 41.08,43.63 41.53,43.18 42.8,43.18 43.31,42.67 43.31,41.15 TP5.TP
  Top 0.203: CON2.9 41.06,38.9 TP5.TP
VBAT
  Top 0.203: CON3.6 39.16,13.67 38.99,13.84 | CON3.1 38.36,8.39 | 38.36,8.39 38.35,8.38 | CON3.3 38.76,8.79 38.36,8.39 | CON3.4 38.76,13.81 38.74,13.84 | CON3.2 38.36,13.83 38.35,13.84
  Top 0.61: 38.99,13.84 38.74,13.84 38.35,13.84 36.58,13.84 36.07,13.34 TP36.TP 36.07,8.89 36.58,8.38 38.35,8.38 | 33.82,11.3 33.82,10.16 R7.1
  Top 0.813: TP36.TP 33.82,11.3 R8.2

### Text on the board
tPlace: GND / 3V3 / / TGT_SWDIO / TGT_SWCLK / TGT_NRESET / TGT_TX1 / TGT_RX1 / TGT_TX5 / TGT_RX5 / I2C3_SDA / I2C3_SCL / SPI3_MOSI / SPI3_MISO / SPI3_SCK | GND / / / / / / / / TGT_TXD2 / TGT_RXD2 | 1 | 0 | Module Carrier / iMX7 WARP / v1.0.0
TopSilkscreen: User PB1 | Boot mode | 1 | 0 | Fuses | 0 | 0 | Manufacture | 0 | 1 | Internal Boot | 1 | 0 | Test Mode | 1 | 1 | BOOT0 | BOOT1 | PMIC_PWR ON | MX7 ON/OFF